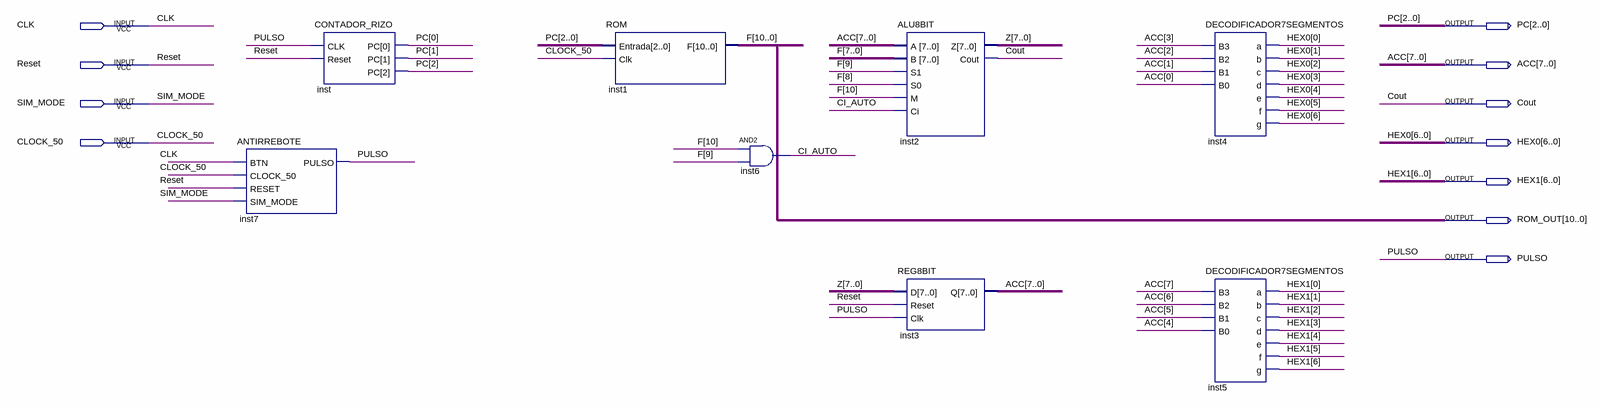
[diagram p0: schematic sheet]
// Quartus schematic PROYECTO_TOP.bdf as structural Verilog: 8 symbols, 11 pins
module PROYECTO_TOP (
  input  CLK,
  input  Reset,
  input  SIM_MODE,
  input  CLOCK_50,
  output [2:0] PC,
  output [7:0] ACC,
  output Cout,
  output [6:0] HEX0,
  output [6:0] HEX1,
  output [10:0] ROM_OUT,
  output PULSO
);

  wire CI_AUTO;
  wire [7:0] Z;
  wire [10:0] F;

  ANTIRREBOTE inst7 (.BTN(CLK), .CLOCK_50(CLOCK_50), .RESET(Reset), .SIM_MODE(SIM_MODE), .PULSO(PULSO));
  CONTADOR_RIZO inst (.CLK(PULSO), .Reset(Reset), .PC(PC));
  ROM inst1 (.Entrada(PC), .Clk(CLOCK_50), .F(F));
  and inst6 (CI_AUTO, F[10], F[9]);
  ALU8BIT inst2 (.A(ACC), .B(F[7:0]), .S1(F[9]), .S0(F[8]), .M(F[10]), .Ci(CI_AUTO), .Z(Z), .Cout(Cout));
  REG8BIT inst3 (.D(Z), .Reset(Reset), .Clk(PULSO), .Q(ACC));
  DECODIFICADOR7SEGMENTOS inst4 (
    .B3(ACC[3]), .B2(ACC[2]), .B1(ACC[1]), .B0(ACC[0]), .a(HEX0[0]), .b(HEX0[1]), .c(HEX0[2]), .d(HEX0[3]),
    .e(HEX0[4]), .f(HEX0[5]), .g(HEX0[6]));
  DECODIFICADOR7SEGMENTOS inst5 (
    .B3(ACC[7]), .B2(ACC[6]), .B1(ACC[5]), .B0(ACC[4]), .a(HEX1[0]), .b(HEX1[1]), .c(HEX1[2]), .d(HEX1[3]),
    .e(HEX1[4]), .f(HEX1[5]), .g(HEX1[6]));
endmodule
